# Altium schematic sheet HumiditySensor.SchDoc
size A4; SheetNumber: 1; SheetTotal: 1
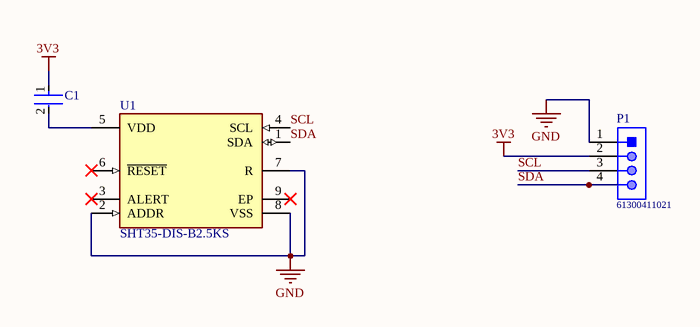
[diagram p0: HumiditySensor.SchDoc]

## Parts
C1  CGA2B1X7R1C104K050BC  [FP-CGA2B-IPC_C]  (value not drawn)
P1  61300411021  [61300411021]
U1  SHT35-DIS-B2.5KS  [FP-SHT35-DIS-B2_5KS-MFG]

## Nets
3V3: C1.1 P1.2
GND: P1.1 U1.2(ADDR) U1.7(R) U1.8(VSS)
SCL: P1.3 U1.4(SCL)
SDA: P1.4 U1.1(SDA)
NetC1_2: C1.2 U1.5(VDD)

Not connected (* = marked no-connect by the designer): U1 3(ALERT)* 6(~{RESET})* 9(EP)*

## Library data of the parts
C1 = CMP-08246-004730-1: Cap Ceramic 100nF 16V X7R 10% Pad SMD 0402 +125°C Automotive T/R; Weight: 2.3E-05oz; Capacitance: 100nF; Thickness: 0.022inch; Length: 1mm; Max Operating Temperature: 125°C; RoHS Compliant: Yes; Voltage Rating: 16V; Voltage Rating (DC): 16V; Series: CGA; Case Code (Metric): 1005; Termination: SMD/SMT; Case/Package: 0402; Tolerance: 10%; Min Operating Temperature: -55°C; Dielectric: X7R; Mount: Surface Mount; Resistor Type: Ceramic; Height: 0.5mm; Depth: 0.5mm; Packaging: Tape and Reel; REACH SVHC: No SVHC; Lead Free: Lead Free; Case Code (Imperial): 0402; Width: 0.5mm; Package Quantity: 1; Ratings: AEC-Q200
P1 = CMP-1502-01063-1: THT Angled Pin Header WR-PHD, Pitch 2.54 mm, Single Row, 4 pins; Manufacturer: Wurth Elektronik; Gender: Male; Pin Number: 4; Withstanding Voltage: 500VAC; Working Voltage: 250VAC; Contact Resistance: 20mOhm; Pitch: 2.54mm; Rated Current: 3A; Manufacturer URL: http://www.we-online.de; Mounting Technology: THT; Publisher: WurthElektronik; Operating Temperature: -40to105degC; Packaging: Bag; Row Number: Single; Package Reference: 61300411021; Part Number: 61300411021; Orientation: Angled; Datasheet URL: https://katalog.we-online.de/em/datasheet/6130xx11021.pdf
U1 = CMP-144040-000010-1: SENSOR HUMI/TEMP 5V I2C 1.5% SMD; RoHS Compliant: Yes